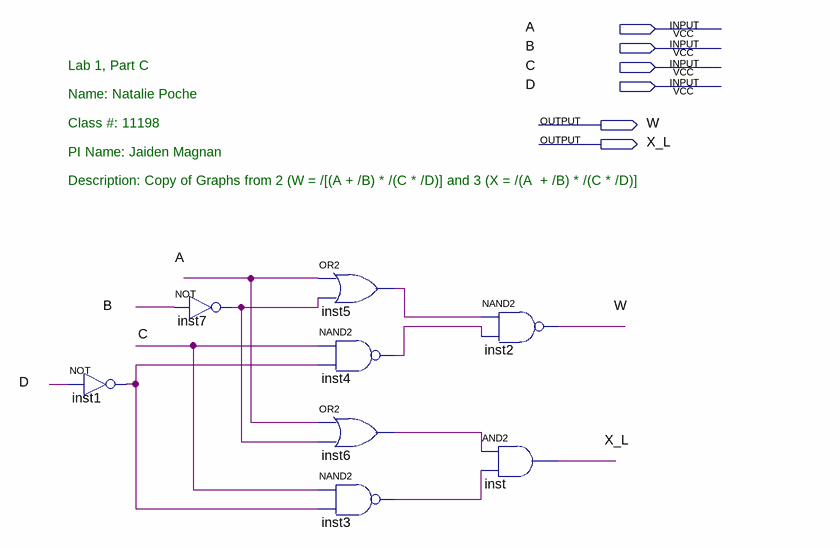
[diagram p0: schematic sheet]
// Quartus schematic Lab1c.bdf as structural Verilog: 8 symbols, 6 pins
module Lab1c (
  input  A,
  input  B,
  input  C,
  input  D,
  output W,
  output X_L
);

  wire inst1_out, inst3_out, inst4_out, inst5_out, inst6_out, inst7_out;

  not inst1 (inst1_out, D);
  not inst7 (inst7_out, B);
  or inst5 (inst5_out, A, inst7_out);
  nand inst4 (inst4_out, C, inst1_out);
  or inst6 (inst6_out, A, inst7_out);
  nand inst3 (inst3_out, C, inst1_out);
  nand inst2 (W, inst5_out, inst4_out);
  and inst (X_L, inst6_out, inst3_out);

  // Notes on the sheet:
  //   Lab 1, Part C
  //   Name: Natalie Poche
  //   Class #: 11198
  //   PI Name: Jaiden Magnan
  //   Description: Copy of Graphs from 2 (W = /[(A + /B) * /(C * /D)] and 3 (X = /(A  + /B) * /(C * /D)]
endmodule
